# Altium project Controller.PrjPcb
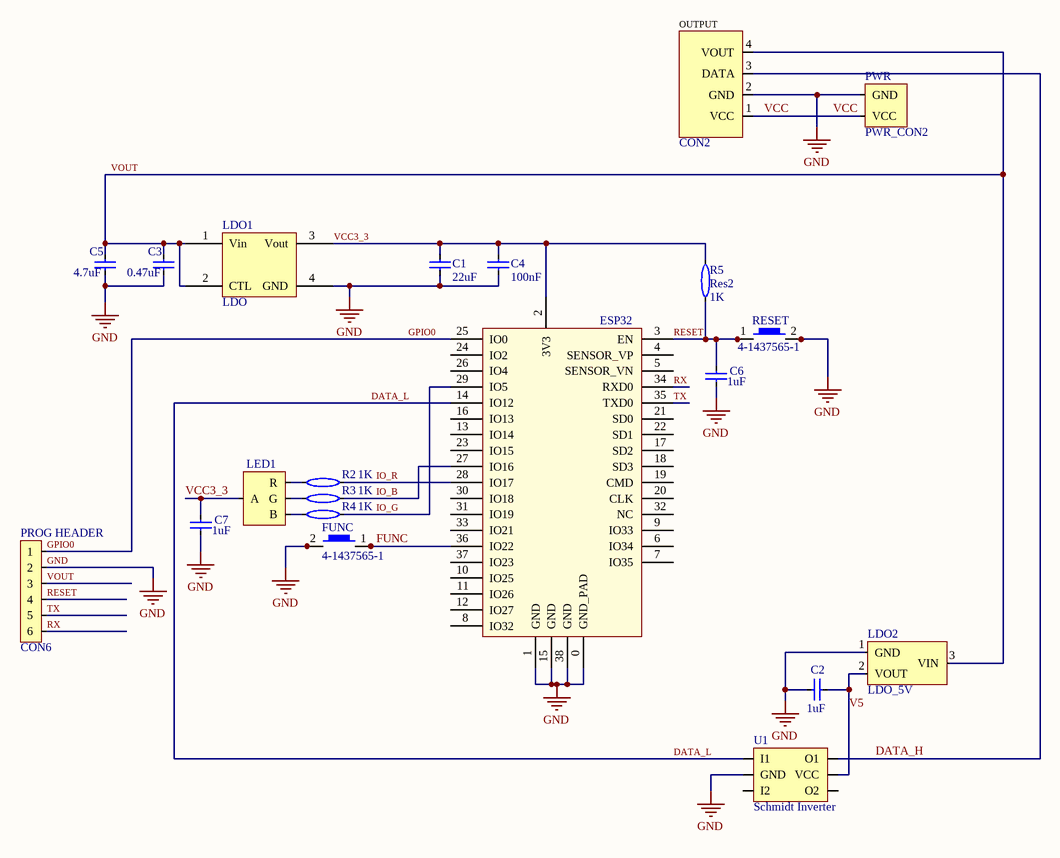
[diagram p0: controller.SchDoc]
Revision: 1
1 sheet, 21 parts. Net scope: global (net labels, ports and power ports of the same name join across sheets).
Board file: controller.PcbDoc

## Sheet controller.SchDoc
size A4

### Parts
C1  value 22uF  [CAPC_1206_3216X16L]  (hidden comment: Cap)
C2  value 1uF  [CAPC_0603_1608X08L]  (hidden comment: Cap)
C3  value 0.47uF  [CAPC_0603_1608X08L]  (hidden comment: Cap)
C4  value 100nF  [CAPC_0603_1608X08L]  (hidden comment: Cap)
C5  value 4.7uF  [CAPC_1206_3216X16L]  (hidden comment: Cap)
C6  value 1uF  [CAPC_0603_1608X08L]  (hidden comment: Cap)
C7  value 1uF  [CAPC_0603_1608X08L]  (hidden comment: Cap)
ESP32  ESP32S_Module  [ESP32S]  (value not drawn)
FUNC  4-1437565-1  [FSM-SWITCH]
LDO1  LDO  [SOT230P700X180-4N]
LDO2  LDO_5V  [SOT23]
LED1  RGB_LED  [PLCC-4]  (value not drawn)
OUTPUT  CON2  [CONNECTOR]  (no BOM)
PROG_HEADER  CON6  [CON2X3]  (no BOM)
PWR  PWR_CON2  [PWR_CON2]  (no BOM)
R2  1K  [RESC_0603_1608X08L]
R3  1K  [RESC_0603_1608X08L]
R4  1K  [RESC_0603_1608X08L]
R5  Res2  value 1K  [RESC_0603_1608X08L]
RESET  4-1437565-1  [FSM-SWITCH]
U1  Schmidt Inverter  [SOT65P210X110-6L]

### Nets
GND: C1.1 C2.1 C3.1 C4.1 C5.1 C6.1 C7.1 ESP32.0(GND_PAD) ESP32.1(GND) ESP32.15(GND) ESP32.38(GND) FUNC.2 FUNC.4 LDO1.4(GND) LDO2.1(GND) OUTPUT.2(GND) PROG_HEADER.2 PWR.2(GND) RESET.2 RESET.4 U1.2(GND)
DATA_H: OUTPUT.3(DATA) U1.6(O1)
DATA_L: ESP32.14(IO12) U1.1(I1)
FUNC: ESP32.36(IO22) FUNC.1 FUNC.3
GPIO0: ESP32.25(IO0) PROG_HEADER.1
IO_B: ESP32.27(IO16) R3.2
IO_G: ESP32.29(IO5) R4.2
IO_R: ESP32.28(IO17) R2.2
RESET: C6.2 ESP32.3(EN) PROG_HEADER.4 R5.1 RESET.1 RESET.3
RX: ESP32.34(RXD0) PROG_HEADER.6
TX: ESP32.35(TXD0) PROG_HEADER.5
V5: C2.2 LDO2.2(VOUT) U1.5(VCC)
VCC: OUTPUT.1(VCC) PWR.1(VCC)
VCC3_3: C1.2 C4.2 C7.2 ESP32.2(3V3) LDO1.3(Vout) LED1.2(A) R5.2
VOUT: C3.2 C5.2 LDO1.1(Vin) LDO1.2(CTL) LDO2.3(VIN) OUTPUT.4(VOUT) PROG_HEADER.3
NetLED1_1: LED1.1(R) R2.1
NetLED1_3: LED1.3(G) R3.1
NetLED1_4: LED1.4(B) R4.1

Not connected (* = marked no-connect by the designer): ESP32 4(SENSOR_VP) 5(SENSOR_VN) 6(IO34) 7(IO35) 8(IO32) 9(IO33) 10(IO25) 11(IO26) 12(IO27) 13(IO14) 16(IO13) 17(SD2) 18(SD3) 19(CMD) 20(CLK) 21(SD0) 22(SD1) 23(IO15) 24(IO2) 26(IO4) 30(IO18) 31(IO19) 32(NC) 33(IO21) 37(IO23); U1 3(I2) 4(O2)

### Library data of the parts
C1-C7 = Cap: Capacitor; Published: 8-Jun-2000; LatestRevisionDate: 17-Jul-2002; LatestRevisionNote: Re-released for DXP Platform.; PackageReference: RAD-0.3; Publisher: Altium Limited; PackageDescription: Radial Cap, Thru-Hole; 2 Leads; 0.3 in Pin Spacing
ESP32 = ESP32S_Module: Esp-32S; Datasheet: https://espressif.com/sites/default/files/documentation/esp_wroom_32_datasheet_en.pdf
FUNC RESET = 4-1437565-1: 6x6mm SMD tactile switch,5mm H 1.6N Black Button Tactile Switch, SPST-NO 0.05 A@ 12 V dc 1.4mm; Manufacturer_Name: TE Connectivity; Allied_Number: R1117787; RS Part Number: 1616046; Manufacturer_Part_Number: 4-1437565-1; Datasheet Link: http://uk.rs-online.com/web/p/products/1616046
LDO1 = LDO: LDO Voltage Regulator
LDO2 = LDO_5V: Microchip MCP1700T-5002E/TT, LDO Regulator, 250mA, 5 V
LED1 = RGB_LED: dot marks common anode
R2-R5 = Res2: Resistor; Published: 8-Jun-2000; LatestRevisionDate: 17-Jul-2002; LatestRevisionNote: Re-released for DXP Platform.; PackageReference: AXIAL-0.4; Publisher: Altium Limited; PackageDescription: Axial Device, Thru-Hole; 2 Leads; 0.4 in Pin Spacing
  R2-R4: Value: 1K
U1 = Schmidt Inverter: ON Semiconductor NLV27WZ14DFT2G